# Altium schematic sheet STSPIN.SchDoc: MCU, Current Sense, Misc
size 431 x 279 mm; Date: 9/19/2024; Author: Kenny Wakaba; DrawnBy: Kenny Wakaba; Revision: V6.0; SheetNumber: 3; SheetTotal: 4
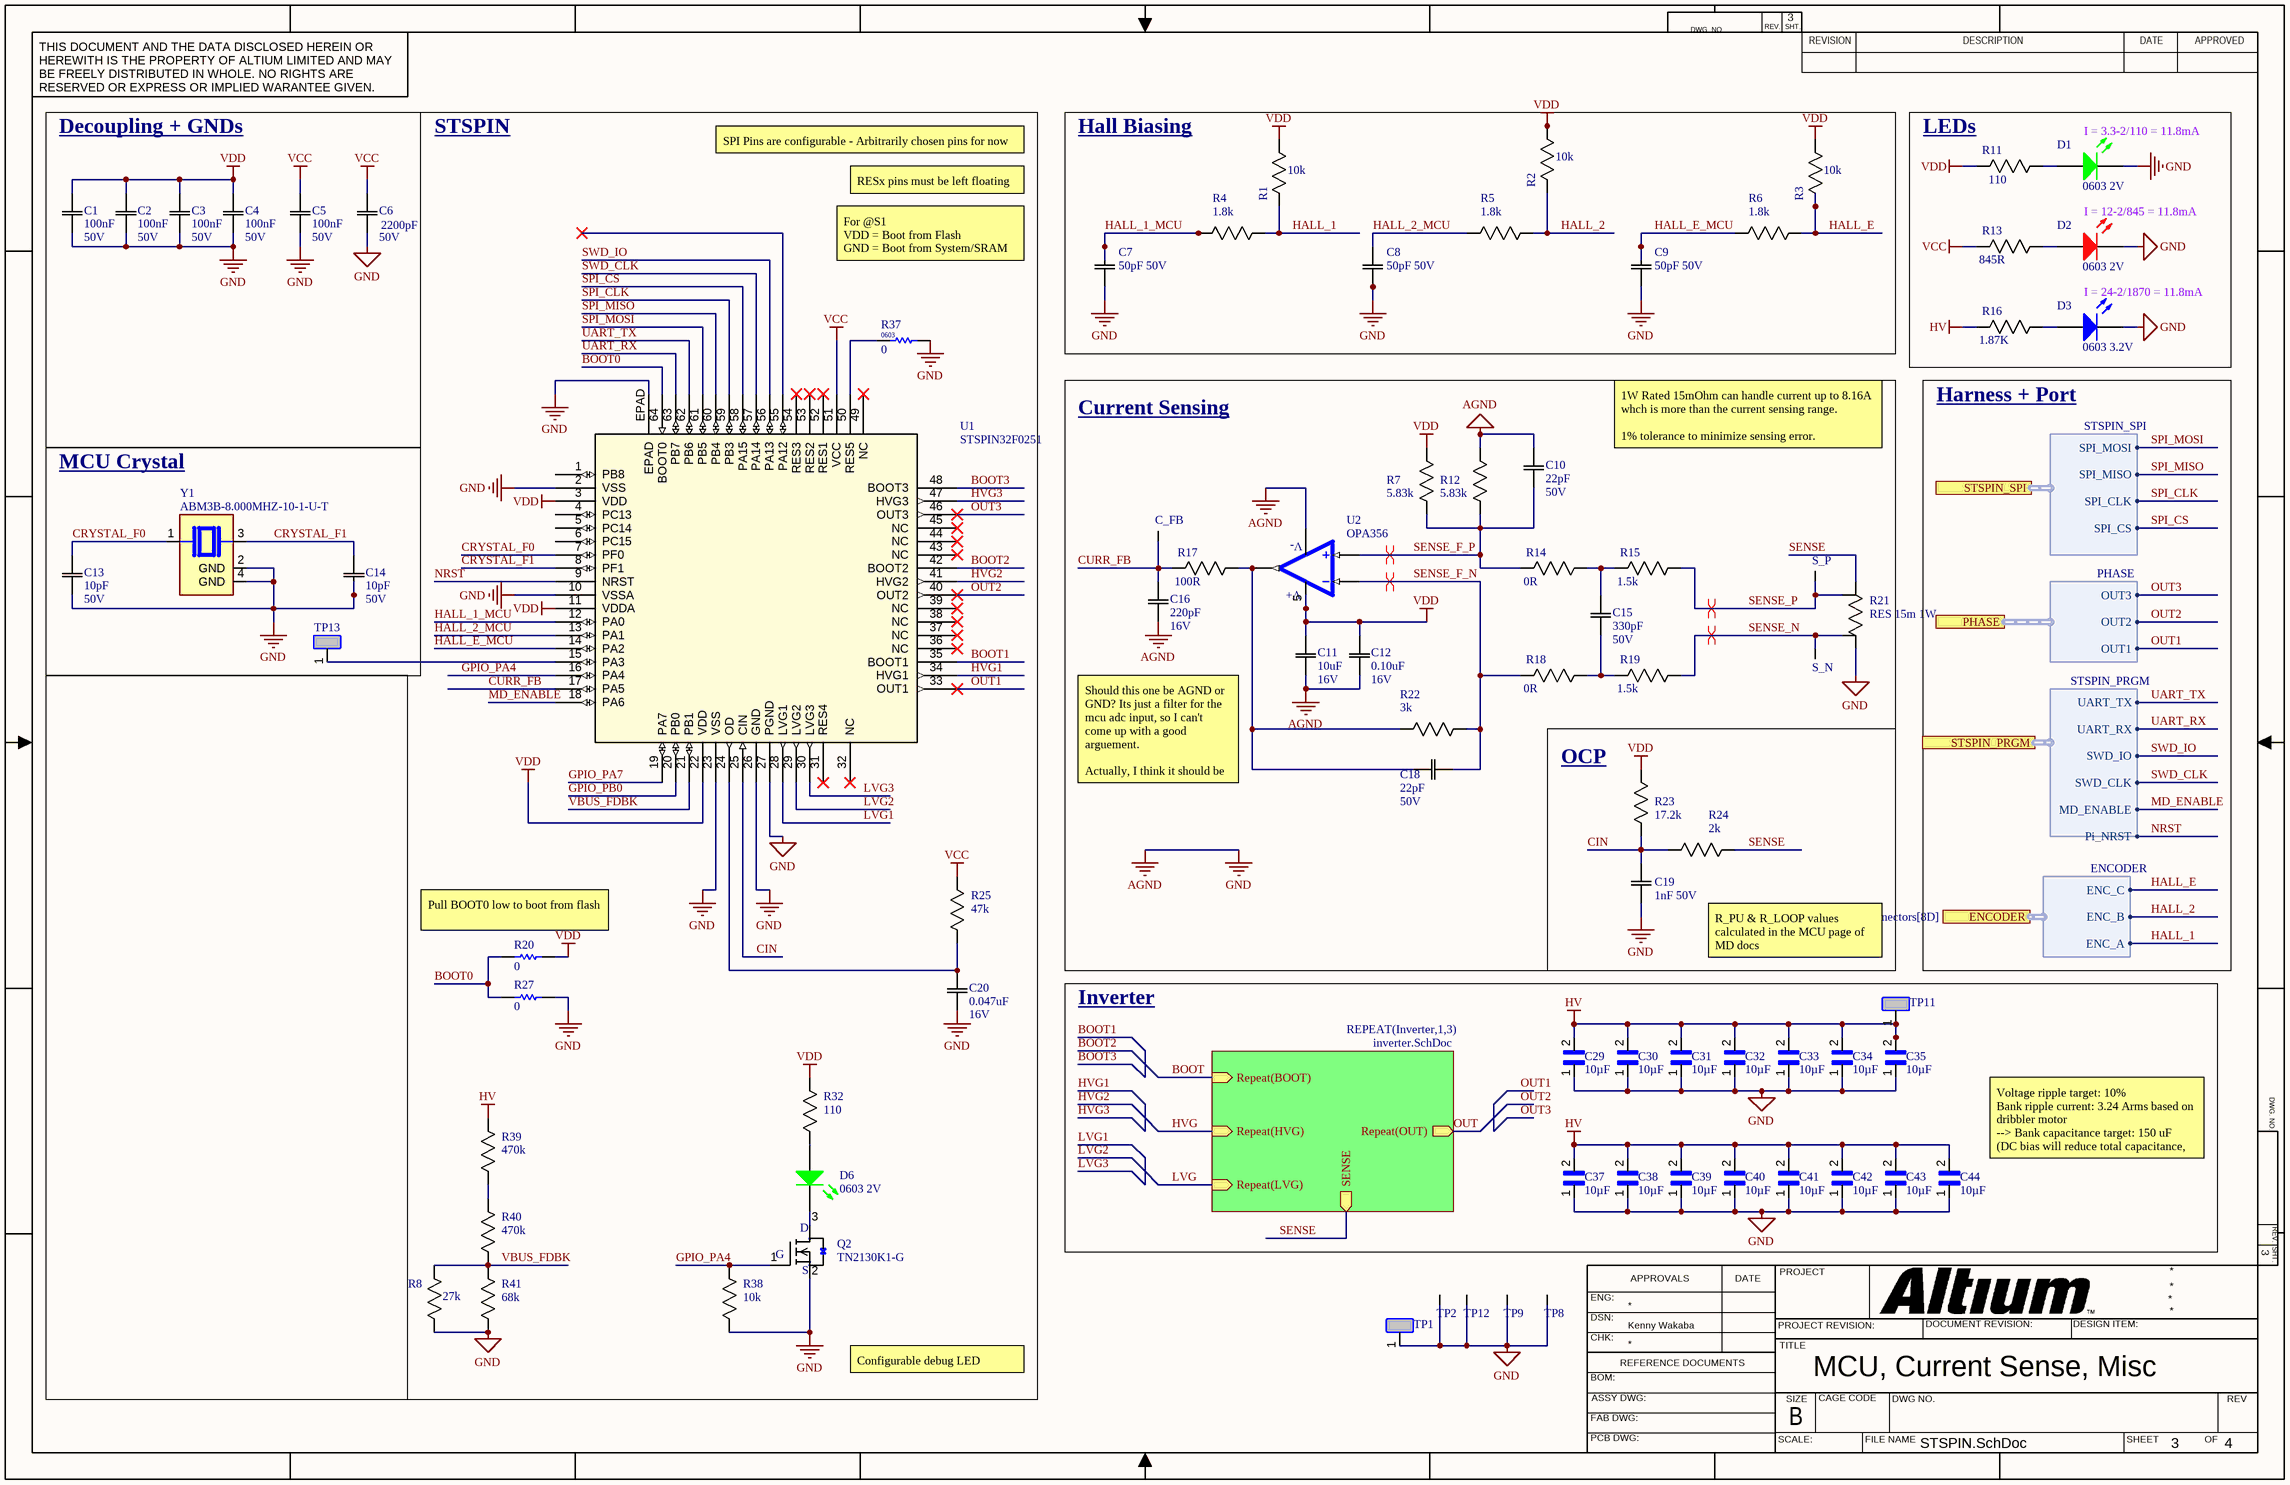
[diagram p0: STSPIN.SchDoc]

## Parts
C1  Rating: 50V  [0603]  (hidden comment: 100nF)
C2  Rating: 50V  [0603]  (hidden comment: 100nF)
C3  Rating: 50V  [0603]  (hidden comment: 100nF)
C4  Rating: 50V  [0603]  (hidden comment: 100nF)
C5  Rating: 50V  [0603]  (hidden comment: 100nF)
C6  Rating: 50V  [0603]  (hidden comment: 2200pF)
C7  50pF 50V  [0603]
C8  50pF 50V  [0603]
C9  50pF 50V  [0603]
C10  Rating: 50V  [0603]  (hidden comment: 22pF)
C11  Rating: 16V  [0603]  (hidden comment: 10uF)
C12  Rating: 16V  [0603]  (hidden comment: 0.10uF)
C13  Rating: 50V  [0603]  (hidden comment: 10pF)
C14  Rating: 50V  [0603]  (hidden comment: 10pF)
C15  Rating: 50V  [0603]  (hidden comment: 330pF)
C16  Rating: 16V  [0603]  (hidden comment: 220pF)
C18  Rating: 50V  [0603]  (hidden comment: 22pF)
C19  1nF 50V  [0603]
C20  Rating: 16V  [0603]  (hidden comment: 0.047uF)
C29  value 10µF  [CAPC2012X145N]  (hidden comment: GRM21BR61H106KE43K)
C30  value 10µF  [CAPC2012X145N]  (hidden comment: GRM21BR61H106KE43K)
C31  value 10µF  [CAPC2012X145N]  (hidden comment: GRM21BR61H106KE43K)
C32  value 10µF  [CAPC2012X145N]  (hidden comment: GRM21BR61H106KE43K)
C33  value 10µF  [CAPC2012X145N]  (hidden comment: GRM21BR61H106KE43K)
C34  value 10µF  [CAPC2012X145N]  (hidden comment: GRM21BR61H106KE43K)
C35  value 10µF  [CAPC2012X145N]  (hidden comment: GRM21BR61H106KE43K)
C37  value 10µF  [CAPC2012X145N]  (hidden comment: GRM21BR61H106KE43K)
C38  value 10µF  [CAPC2012X145N]  (hidden comment: GRM21BR61H106KE43K)
C39  value 10µF  [CAPC2012X145N]  (hidden comment: GRM21BR61H106KE43K)
C40  value 10µF  [CAPC2012X145N]  (hidden comment: GRM21BR61H106KE43K)
C41  value 10µF  [CAPC2012X145N]  (hidden comment: GRM21BR61H106KE43K)
C42  value 10µF  [CAPC2012X145N]  (hidden comment: GRM21BR61H106KE43K)
C43  value 10µF  [CAPC2012X145N]  (hidden comment: GRM21BR61H106KE43K)
C44  value 10µF  [CAPC2012X145N]  (hidden comment: GRM21BR61H106KE43K)
C_FB  Test Point (Via)  [TP]  (value not drawn)  (no BOM)
D1  0603 2V  [0603 - LED]
D2  0603 2V  [0603 - LED]
D3  0603 3.2V  [0603 - LED]
D6  0603 2V  [0603 - LED]
Q2  TN2130K1-G  [SOT95P237X112-3N]
R1  value 10k  [0603]  (hidden comment: RES 10k 1/8W - 1%)
R2  value 10k  [0603]  (hidden comment: RES 10k 1/8W - 1%)
R3  value 10k  [0603]  (hidden comment: RES 10k 1/8W - 1%)
R4  1.8k  [0603]
R5  1.8k  [0603]
R6  1.8k  [0603]
R7  5.83k  [0603]
R8  value 27k  [0603]  (hidden comment: RES 27k 1/8W)
R11  110  [0603]
R12  5.83k  [0603]
R13  845R  [0603]
R14  0R  [0603]
R15  1.5k  [0603]
R16  1.87K  [0603]
R17  100R  [0603]
R18  0R  [0603]
R19  1.5k  [0603]
R20  value 0  [RESC1005X40X25ML05T10]  (hidden comment: Resistor 0R 0402 63 mW)
R21  RES 15m 1W  [1206 - Current Sense]
R22  3k  [0603]
R23  17.2k  [0603]
R24  2k  [0603]
R25  47k  [0603]
R27  value 0  [RESC1005X40X25ML05T10]  (hidden comment: Resistor 0R 0402 63 mW)
R32  110  [0603]
R37  value 0  [0603 IPC Class B]  (hidden comment: Resistor 0R 0.1W 0603)
R38  10k  [0603]
R39  470k  [0603]
R40  470k  [0603]
R41  68k  [0603]
S_N  Test Point (Via)  [TP]  (value not drawn)  (no BOM)
S_P  Test Point (Via)  [TP]  (value not drawn)  (no BOM)
TP1  RCT-0C  [RCT-0C-Footprint-1]  (value not drawn)
TP2  Test Point (Via)  [TP]  (value not drawn)  (no BOM)
TP8  Test Point (Via)  [TP]  (value not drawn)  (no BOM)
TP9  Test Point (Via)  [TP]  (value not drawn)  (no BOM)
TP11  RCT-0C  [RCT-0C-Footprint-1]  (value not drawn)
TP12  Test Point (Via)  [TP]  (value not drawn)  (no BOM)
TP13  RCT-0C  [RCT-0C-Footprint-1]  (value not drawn)
U1  STSPIN32F0251  [TQFP64_10X10_STM-M]
U2  OPA356  [SOT-23-5_MC_MCH-L]
Y1  ABM3B-8.000MHZ-10-1-U-T  [XTAL_ABM3B-8.000MHZ-10-1-U-T]

## Blocks framed on the sheet
Decoupling + GNDs: C1-C6
STSPIN: C20 D6 Q2 R8 R20 R25 R27 R32 R37-R41 U1
Hall Biasing: C7-C9 R1-R6
LEDs: D1-D3 R11 R13 R16
Current Sensing: C10-C12 C15 C16 C18 C_FB R7 R12 R14 R15 R17-R19 R21 R22 S_N S_P U2
MCU Crystal: C13 C14 TP13 Y1
OCP: C19 R23 R24
Inverter: C29-C35 C37-C44 TP11

## Sub-sheets
REPEAT(Inverter,1,3) = inverter.SchDoc: Repeat(BOOT) (in), Repeat(HVG) (in), Repeat(LVG) (in), Repeat(OUT) (out), SENSE (out)

## Ports
ENCODER (harness ENCODER, see root[2B], connectors[8D]), PHASE (harness PHASE, see root[2B], connectors[8E]), STSPIN_PRGM (harness STSPIN_PRGM, see root[2B], connectors[8D]), STSPIN_SPI (harness STSPIN_SPI, see root[2B], connectors[8F])

## Harnesses
STSPIN_SPI: SPI_MOSI, SPI_MISO, SPI_CLK, SPI_CS
PHASE: OUT3, OUT2, OUT1
STSPIN_PRGM: SWD_IO, SWD_CLK, UART_TX, UART_RX, MD_ENABLE, Pi_NRST
ENCODER: ENC_C, ENC_B, ENC_A

## Nets
AGND: C1.1(C1) C2.1(C1) C3.1(C1) C4.1(C1) C5.1(C1) C6.1(C1) C7.1(C1) C8.1(C1) C9.1(C1) C10.2(C2) C11.1(C1) C12.1(C1) C13.1(C1) C14.1(C1) C16.1(C1) C19.1(C1) C20.1(C1) C29.1 C30.1 C31.1 C32.1 C33.1 C34.1 C35.1 C37.1 C38.1 C39.1 C40.1 C41.1 C42.1 C43.1 C44.1 D1.2(K) D2.2(K) D3.2(K) Q2.2(S) R8.2(R2) R12.1(R1) R21.2 R27.2 R37.2 R38.1(R1) R41.1(R1) TP1.1(SIGNAL) TP2.1 TP8.1 TP9.1 TP12.1 U1.2(VSS) U1.10(VSSA) U1.23(VSS) U1.26(GND) U1.27(PGND) U1.EPAD U2.2(V-) Y1.2(GND) Y1.4(GND)  [also labelled GND]
HV: C29.2 C30.2 C31.2 C32.2 C33.2 C34.2 C35.2 C37.2 C38.2 C39.2 C40.2 C41.2 C42.2 C43.2 C44.2 R16.2(R2) R39.1(R1) TP11.1(SIGNAL)
VCC: C5.2(C2) C6.2(C2) R13.2(R2) R25.2(R2) U1.51(VCC)
VDD: C1.2(C2) C2.2(C2) C3.2(C2) C4.2(C2) C11.2(C2) C12.2(C2) R1.1(R1) R2.1(R1) R3.1(R1) R7.1(R1) R11.2(R2) R20.2 R23.1(R1) R32.2(R2) U1.3(VDD) U1.11(VDDA) U1.22(VDD) U2.5(V+)
BOOT: sheet REPEAT(Inverter,1,3)/Repeat(BOOT)
BOOT0: R20.1 R27.1 U1.64(BOOT0)
BOOT1: U1.35(BOOT1)
BOOT2: U1.42(BOOT2)
BOOT3: U1.48(BOOT3)
CIN: C19.2(C2) R23.2(R2) R24.2(R2) U1.25(CIN)
CRYSTAL_F0: C13.2(C2) U1.7(PF0) Y1.1
CRYSTAL_F1: C14.2(C2) U1.8(PF1) Y1.3
CURR_FB: C16.2(C2) C_FB.1 R17.2(R2) U1.17(PA5)
GPIO_PA4: Q2.1(G) R38.2(R2) U1.16(PA4)
GPIO_PA7: U1.19(PA7)
GPIO_PB0: U1.20(PB0)
HALL_1: R1.2(R2) R4.1(R1) ; port ENCODER.ENC_A
HALL_1_MCU: C7.2(C2) R4.2(R2) U1.12(PA0)
HALL_2: R2.2(R2) R5.1(R1) ; port ENCODER.ENC_B
HALL_2_MCU: C8.2(C2) R5.2(R2) U1.13(PA1)
HALL_E: R3.2(R2) R6.1(R1) ; port ENCODER.ENC_C
HALL_E_MCU: C9.2(C2) R6.2(R2) U1.14(PA2)
HVG: sheet REPEAT(Inverter,1,3)/Repeat(HVG)
HVG1: U1.34(HVG1)
HVG2: U1.41(HVG2)
HVG3: U1.47(HVG3)
LVG: sheet REPEAT(Inverter,1,3)/Repeat(LVG)
LVG1: U1.28(LVG1)
LVG2: U1.29(LVG2)
LVG3: U1.30(LVG3)
MD_ENABLE: U1.18(PA6) ; port STSPIN_PRGM.MD_ENABLE
NRST: U1.9(NRST) ; port STSPIN_PRGM.Pi_NRST
OUT: sheet REPEAT(Inverter,1,3)/Repeat(OUT)
OUT1: U1.33(OUT1) ; port PHASE.OUT1
OUT2: U1.40(OUT2) ; port PHASE.OUT2
OUT3: U1.46(OUT3) ; port PHASE.OUT3
SENSE: R21.1 R24.1(R1) ; sheet REPEAT(Inverter,1,3)/SENSE
SENSE_F_N: C18.2(C2) R18.2(R2) R22.1(R1) U2.4(IN-)
SENSE_F_P: C10.1(C1) R7.2(R2) R12.2(R2) R14.2(R2) U2.3(IN+)
SENSE_N: R19.1(R1) R21.S2 S_N.1
SENSE_P: R15.1(R1) R21.S1 S_P.1
SPI_CLK: U1.59(PB3) ; port STSPIN_SPI.SPI_CLK
SPI_CS: U1.58(PA15) ; port STSPIN_SPI.SPI_CS
SPI_MISO: U1.60(PB4) ; port STSPIN_SPI.SPI_MISO
SPI_MOSI: U1.61(PB5) ; port STSPIN_SPI.SPI_MOSI
SWD_CLK: U1.57(PA14) ; port STSPIN_PRGM.SWD_CLK
SWD_IO: U1.56(PA13) ; port STSPIN_PRGM.SWD_IO
UART_RX: U1.63(PB7) ; port STSPIN_PRGM.UART_RX
UART_TX: U1.62(PB6) ; port STSPIN_PRGM.UART_TX
VBUS_FDBK: R8.1(R1) R40.2(R2) R41.2(R2) U1.21(PB1)
NetC15_1: C15.1(C1) R18.1(R1) R19.2(R2)
NetC15_2: C15.2(C2) R14.1(R1) R15.2(R2)
NetC18_1: C18.1(C1) R17.1(R1) R22.2(R2) U2.1(OUT)
NetC20_2: C20.2(C2) R25.1(R1) U1.24(OD)
NetD1_1: D1.1(A) R11.1(R1)
NetD2_1: D2.1(A) R13.1(R1)
NetD3_1: D3.1(A) R16.1(R1)
NetD6_1: D6.1(A) R32.1(R1)
NetD6_2: D6.2(K) Q2.3(D)
NetR37_1: R37.1 U1.50(RES5)
NetR39_2: R39.2(R2) R40.1(R1)
NetTP13_1: TP13.1(SIGNAL) U1.15(PA3)

Not connected (* = marked no-connect by the designer): U1 1(PB8) 4(PC13) 5(PC14) 6(PC15) 31(RES4)* 32(NC)* 36(NC)* 37(NC)* 38(NC)* 39(NC)* 43(NC)* 44(NC)* 45(NC)* 49(NC)* 52(RES1)* 53(RES2)* 54(RES3)* 55(PA12)*

## Layout directives
differential pair: SENSE_F_N, SENSE_F_P, SENSE_N, SENSE_P

## Notes on the sheet
- SPI Pins are configurable - Arbitrarily chosen pins for now
- (near D1) I = 3.3-2/110 = 11.8mA
- RESx pins must be left floating
- I = 12-2/845 = 11.8mA
- For @S1
  VDD = Boot from Flash
  GND = Boot from System/SRAM
- I = 24-2/1870 = 11.8mA
- Harness + Port
- 1W Rated 15mOhm can handle current up to 8.16A whch is more than the current sensing range.
  1% tolerance to minimize sensing error.
- Should this one be AGND or GND? Its just a filter for the mcu adc input, so I can't come up with a good arguement.
  Actually, I think it should be AGND
- (near R20) Pull BOOT0 low to boot from flash
- R_PU & R_LOOP values calculated in the MCU page of MD docs
- (near C44) Voltage ripple target: 10%
  Bank ripple current: 3.24 Arms based on dribbler motor
  --> Bank capacitance target: 150 uF
  (DC bias will reduce total capacitance, so using 16 x 10 uF)
- Configurable debug LED
- DWG. NO.
- REV.
- SHT.
- THIS DOCUMENT AND THE DATA DISCLOSED HEREIN OR HEREWITH IS THE PROPERTY OF ALTIUM LIMITED AND MAY BE FREELY DISTRIBUTED IN WHOLE. NO RIGHTS ARE RESERVED OR EXPRESS OR IMPLIED WARANTEE GIVEN.
- REVISION
- DESCRIPTION
- DATE
- APPROVED
- ENG:
- APPROVALS
- PROJECT
- DSN:
- CHK:
- REFERENCE DOCUMENTS
- PROJECT REVISION:
- TITLE
- DOCUMENT REVISION:
- DESIGN ITEM:
- BOM:
- FAB DWG:
- PCB DWG:
- ASSY DWG:
- SCALE:
- SIZE
- B
- CAGE CODE
- FILE NAME
- DWG NO.
- SHEET
- OF
- REV

## Library data of the parts
C1-C5 = CAP 100nF 50V: Default Symbol for Capacitors; Manufacturer Part Number 1: CC0603KPX7R9BB104; Temperature Coefficient: X7R; Tolerance: 10%; Value: 100nF; Part Number: CAP 100nF 50V; Supplier 1: Digi-Key; Supplier Part Number 1: 311-3567-1-ND; Manufacturer Part Number 2: 0805J0500104KJT; Supplier 2: Digi-Key; Supplier Part Number 2: 1608-1458-1-ND
C6 = CAP 2200pF 50V: Default Symbol for Capacitors; Manufacturer Part Number 1: 06035C222KAT2A; Temperature Coefficient: X7R; Tolerance: 10%; Value: 2200pF; Part Number: CAP 2200pF 50V; Supplier 1: Digi-Key; Supplier Part Number 1: 478-1219-1-ND; Manufacturer Part Number 2: CL21B222KBANNNC; Supplier 2: Digi-Key; Supplier Part Number 2: 1276-1171-1-ND
C7-C9 = CAP 50pF 50V: 50 pF ±5% 50V Ceramic Capacitor C0G, NP0 0603 (1608 Metric); Value: 10nF; Tolerance: 10%; Temperature Coefficient: X7R; Package: 0805; Rating: 50V; Operating Temperature: -55°C ~ 125°C; Supplier 1: Digikey; Supplier Part Number 1: 13-CC0603JRNPO9BN500CT-ND
C10 C18 = CAP 22pF 50V: Default Symbol for Capacitors; Temperature Coefficient: X7R; Tolerance: 10%; Value: 22pF; Part Number: CAP 22pF 50V
C11 = CAP 10uF 16V: CAP CER 10UF 16V X5R 0603/0805; Tolerance: 10%; Package: 0603/0805; Temperature Coefficient: X5R; Operating Temperature: -55°C ~ 85°C; Value: 10uF; Part Number: CAP 10uF 16V
C12 = CAP 0.10uF 16V: CAP CER 0.10UF 16V X5R 0603; Tolerance: 10%; Package: 0603/0805; Temperature Coefficient: X5R; Operating Temperature: -55°C ~ 85°C; Value: 0.10uF; Part Number: CAP 0.10uF 16V
C13 C14 = CAP 10pF 50V: Default Symbol for Capacitors; Temperature Coefficient: X7R; Tolerance: 10%; Value: 10pF; Part Number: CAP 10pF 50V
C15 = CAP 330pF 50V: Default Symbol for Capacitors; Temperature Coefficient: X7R; Tolerance: 10%; Value: 330pF; Part Number: CAP 330pF 50V
C16 = CAP 220pF 16V: Default Symbol for Capacitors; Temperature Coefficient: X5R; Tolerance: 10%; Value: 220pF; Part Number: CAP 220pF 16V
C19 = CAP 1nF 50V: CAP CER 0603 1NF 50V X7R 10%; Value: 10nF; Package: 0805; Rating: 50V; Tolerance: 10%; Temperature Coefficient: X7R; Operating Temperature: -55°C ~ 125°C; Supplier 1: Mouser; Supplier Part Number 1: 80-C0603X102K5R3316
C20 = CAP 0.047uF 16V: Default Symbol for Capacitors; Temperature Coefficient: X5R; Tolerance: 10%; Value: 0.047uF; Part Number: CAP 0.047uF 16V
C29-C35 C37-C44 = CMP-001-00612-1: SMD capacitor X5R(EIA) with capacitance 10uF Tol.10%. Rated voltage 50Vdc 85C; MF: Murata; Component Type: Standard; Case/Package: 2012 Murata; Source: GRM21BR61H106KE43K.SchLib; Check_prices: https://www.snapeda.com/parts/GRM21BR61H106KE43K/Murata/view-part/?ref=eda; MP: GRM21BR61H106KE43K; Pins: 2; Design Item ID: GRM21BR61H106KE43K; SnapEDA_Link: https://www.snapeda.com/parts/GRM21BR61H106KE43K/Murata/view-part/?ref=snap
C_FB S_N S_P TP2 TP8 TP9 TP12 = CMP-024-000001-1: Part Number: Test Point (Via)
D1 D6 = LED GREEN SMD 0603: Green 570nm LED Indication - Discrete 2V 0603 (1608 Metric); Supplier 1: Digikey; Supplier Part Number 1: 732-4980-1-ND
D2 = LED RED SMD 0603: Red 625nm LED Indication - Discrete 2V 0603 (1608 Metric); Supplier 1: Digikey; Supplier Part Number 1: 732-4978-1-ND
D3 = LED BLUE SMD 0603: Blue 470nm LED Indication - Discrete 3.2V 0603 (1608 Metric); Supplier 1: Digikey; Supplier Part Number 1: 732-4966-1-ND
Q2 = MOSFET N-CH TN2130K1-G: N-Channel 300 V 85mA (Tj) 360mW (Tc) Surface Mount TO-236AB (SOT23); Mfr_Name: Microchip; Type: DEV; Copyright: Copyright (C) 2021 Ultra Librarian. All rights reserved.; Manufacturer_Part_Number: TN2130K1-G; Digi-Key_Part_Number_1: TN2130K1-GCT-ND; Digi-Key_Part_Number_2: TN2130K1-GDKR-ND; Digi-Key_Part_Number_3: TN2130K1-GTR-ND; RefDes: RefDes; Supplier 1: Digi-Key; Supplier Part Number 1: TN2130K1-GCT-ND; Part Number: MOSFET N-CH TN2130K1-G; Manufacturer Part Number 1: TN2130K1-G; Supplier URL 1: https://www.digikey.com/en/products/detail/microchip-technology/TN2130K1-G/4902939
R1-R3 = CMP-009-00203-1: Manufacturer Part Number 1: ERJ-H3GJ103V; Tolerance: 5%; Tolerance 2: 5%; Supplier URL 2: https://www.digikey.ca/en/products/detail/stackpole-electronics-inc/RMCF0805JT10K0/1757762?s=N4IgTCBcDaIEoFkDCAxADADjQVgFIBUBGNAaTSXxAF0BfIA; Supplier URL 1: https://www.digikey.ca/en/products/detail/panasonic-electronic-components/ERJ-H3GJ103V/13877876?s=N4IgTCBcDaIIwAYC0BRASgKSQCQMwHENFcA1AYQBUkA5AERAF0BfIA; Part Number: RES 10k 1/8W - 1%; Manufacturer Part Number 2: RMCF0805JT10K0
R4-R6 = RES 1.8k 1/8W: Default Resistor Symbol; Power (Watts): 0.125W; Tolerance: 5%; Package: 0805; Value: 1.8k; Part Number: RES 1.8k 1/8W
R7 R12 = RES 5.83k 1/10W 0.1%: RES 5.83K OHM 0.1% 1/10W 0603; Value: 8.45k; Power (Watts): 0.125W; Tolerance: 1%; Package: 0603; Supplier 1: Digikey; Supplier Part Number 1: 2019-RN73H1JTTD5831B25CT-ND
R8 = CMP-009-00271-1: Part Number: RES 27k 1/8W
R11 R32 = RES 110.0 1/8W - 1%: Default Resistor Symbol; Manufacturer Part Number 1: RMCF0603FT110R; Power (Watts): 0.125W; Tolerance: 1%; Package: 0805; Value: 110; Part Number: RES 110.0 1/8W - 1%; Supplier 1: Digi-Key; Supplier Part Number 1: RMCF0603FT110RCT-ND; Supplier URL 1: https://www.digikey.ca/en/products/detail/stackpole-electronics-inc/RMCF0603FT110R/1761268
R13 = RES 845 1/10W 1%: RES 845 OHM 1% 1/10W 0603; Value: 8.45k; Power (Watts): 0.125W; Package: 0603; Tolerance: 1%; Supplier 1: Future Electronics; Supplier Part Number 1: 7098270
R14 = RES 100R 1/10W 0.05%: 0 OHM 1/10W 0603; Value: 8.45k; Power (Watts): 0.125W; Tolerance: 1%; Package: 0603; Supplier 1: Digikey; Supplier Part Number 1: RG16N100WCT-ND
R15 R19 = RES 100R 1/10W 0.05%: RES SMD 1.5k OHM 0.05% 1/10W 0603; Value: 8.45k; Power (Watts): 0.125W; Tolerance: 1%; Package: 0603; Supplier 1: Digikey; Supplier Part Number 1: RG16N100WCT-ND
R16 = RES 1.87K 1/10W 1%: RES 1.87K OHM 1% 1/10W 0603; Value: 8.45k; Power (Watts): 0.125W; Package: 0603; Tolerance: 1%; Supplier 1: Future Electronics; Supplier Part Number 1: 2610988
R17 = RES 100R 1/10W 0.05%: RES SMD 100 OHM 0.05% 1/10W 0603; Value: 8.45k; Power (Watts): 0.125W; Tolerance: 1%; Package: 0603; Supplier 1: Digikey; Supplier Part Number 1: RG16N100WCT-ND
R18 = RES 100R 1/10W 0.05%: 0 OHM  1/10W 0603; Value: 8.45k; Power (Watts): 0.125W; Tolerance: 1%; Package: 0603; Supplier 1: Digikey; Supplier Part Number 1: RG16N100WCT-ND
R20 R27 = CMP-009-00004-5: Chip Resistor, 0 Ohm, 0.063 W, -55 to 155 degC, 0402 (1005 Metric); Power: 63mW; Voltage Rating: 50V; Max Operating Temperature: 155°C; Pins: 2; RoHS Compliant: True; Min Operating Temperature: -55°C; Mounting Technology: SM; Case/Package: 0402
R21 = RES 15m 1W: 1W 0.015 OHM METAL ALLOY CS 1% C 1206; ComponentLink1Description: New link; ComponentLink1URL: https://www.digikey.ca/en/products/detail/ohmite/MCS1632R015DER/22672431; Supplier 1: Digikey; Supplier Part Number 1: 273-MCS1632R015DERCT-ND
R22 = RES 5.83k 1/10W 0.1%: RES 3K OHM 0.1% 1/10W 0603; Value: 8.45k; Power (Watts): 0.125W; Tolerance: 1%; Package: 0603; Supplier 1: Digikey; Supplier Part Number 1: 2019-RN73H1JTTD5831B25CT-ND
R23 = RES 17.2k 1/10W 0.1%: RES 17.2k OHM 0.1% 1/10W 0603; Value: 8.45k; Power (Watts): 0.125W; Tolerance: 1%; Package: 0603; Supplier 1: Digikey; Supplier Part Number 1: 2019-RN73H1JTTD1722B25CT-ND
R24 = RES 2k 1/8W: Default Resistor Symbol; Power (Watts): 0.125W; Tolerance: 5%; Package: 0805; Value: 2k; Part Number: RES 2k 1/8W
R25 = RES 47k 1/8W - 1%: Default Resistor Symbol; Manufacturer Part Number 1: MCT06030C4702FP500; Power (Watts): 0.125W; Tolerance: 1%; Package: 0805; Value: 47k; Part Number: RES 47k 1/8W - 1%; Supplier 1: Digi-Key; Supplier Part Number 1: MCT0603-47.0K-CFCT-ND; Supplier URL 1: https://www.digikey.ca/en/products/detail/vishay-beyschlag-draloric-bc-components/MCT06030C4702FP500/2607854?s=N4IgTCBcDaILIGEAqAGAbCgzAWgCwHYA6FAaWwQDFlsA5AERAF0BfIA
R37 = CMP-009-00399-1: Fixed Resistor, Metal Glaze/thick Film, 0.1W, 0ohm, Surface Mount, 0603; Power: 100mW; Min Operating Temperature: -55°C; Max Operating Temperature: 155°C; RoHS Compliant: Yes; Pins: 2; Mounting Technology: Surface Mount; Case/Package: 0603
R38 = RES 10k 1/8W - 1%: Default Resistor Symbol; Manufacturer Part Number 1: ERJ-H3GJ103V; Power (Watts): 0.125W; Tolerance: 5%; Package: 0805; Value: 10k; Part Number: RES 10k 1/8W - 1%; Supplier 1: Digi-Key; Supplier Part Number 1: 10-ERJ-H3GJ103VCT-ND; Supplier URL 1: https://www.digikey.ca/en/products/detail/panasonic-electronic-components/ERJ-H3GJ103V/13877876?s=N4IgTCBcDaIIwAYC0BRASgKSQCQMwHENFcA1AYQBUkA5AERAF0BfIA; Manufacturer Part Number 2: RMCF0805JT10K0; Supplier 2: Digi-Key; Supplier Part Number 2: RMCF0805JT10K0CT-ND; Supplier URL 2: https://www.digikey.ca/en/products/detail/stackpole-electronics-inc/RMCF0805JT10K0/1757762?s=N4IgTCBcDaIEoFkDCAxADADjQVgFIBUBGNAaTSXxAF0BfIA; Tolerance 2: 5%
R39 R40 = RES 470k 1/8W: Default Resistor Symbol; Power (Watts): 0.125W; Tolerance: 5%; Package: 0805; Value: 470k; Part Number: RES 470k 1/8W
R41 = RES 68k 1/8W: Default Resistor Symbol; Power (Watts): 0.125W; Tolerance: 5%; Package: 0805; Value: 68k; Part Number: RES 68k 1/8W
TP1 TP11 TP13 = CMP-024-000003-4: Metal Foil, 0W, 0.05ohm, Surface Mount, 0805; Manufacturer Part Number 1: RCT-0C
U1 = STSPIN32F0251: No Description Available; Mfr_Name: STMicroelectronics; RefDes: RefDes; Type: Type
U2 = OPA356: IC OPAMP VFB 1 CIRCUIT SOT23-5; Manufacturer: Analog Devices; Manufacturer Part Number: ADA4505-1ARJZ-R7; RoHS: Yes; Category: Amplifiers - Op Amps, Buffer, Instrumentation; Number of Pins: 5; Max Operating Temperature: 125°C; REACH SVHC: No SVHC; ComponentLink1URL: https://datasheet.ciiva.com/22712/1610797-22712032.pdf?src-supplier=Element14; ComponentLink1Description: https://datasheet.ciiva.com/22712/1610797-22712032.pdf?src-supplier=Element14; ComponentLink2URL: https://datasheet.ciiva.com/23805/608874-23805844.pdf?src-supplier=Newark; ComponentLink2Description: https://datasheet.ciiva.com/23805/608874-23805844.pdf?src-supplier=Newark; ComponentLink3URL: https://datasheet.ciiva.com/1487/1610797-1487372.pdf?src-supplier=Element14; ComponentLink3Description: https://datasheet.ciiva.com/1487/1610797-1487372.pdf?src-supplier=Element14; Digikey: ADA4505-1ARJZ-R7CT-ND; Supplier 1: Mouser; Supplier Part Number 1: 595-OPA356AIDBVR
Y1 = ABM3B-8.000MHZ-10-1-U-T: 8 MHz Â±10ppm Crystal 10pF 200 Ohms 4-SMD, No Lead; MF: Abracon; Value: *; Package: SMD-4 Abracon LLC; SnapEDA_Link: https://www.snapeda.com/parts/ABM3B-8.000MHZ-10-1-U-T/Abracon+LLC/view-part/?ref=snap; MP: ABM3B-8.000MHZ-10-1-U-T; Purchase-URL: https://pricing.snapeda.com/search/part/ABM3B-8.000MHZ-10-1-U-T/?ref=eda; Availability: In Stock; Price: None; Check_prices: https://www.snapeda.com/parts/ABM3B-8.000MHZ-10-1-U-T/Abracon+LLC/view-part/?ref=eda